# Altium schematic sheet FanBot.SchDoc: Kekketek FanBot
size B; Date: 06/04/2013; ApprovedBy: 6996-1300-0801; CheckedBy: Marcel Lukkesen; DrawnBy: Jacinto Garcia; Engineer: Jacinto Garcia; Organization: J; DocumentNumber: 1; Revision: R01; SheetNumber: 1; SheetTotal: 1; Partnumber: L; ModifiedDate: Ij; ImagePath: Z; ProjectName: Fanbot
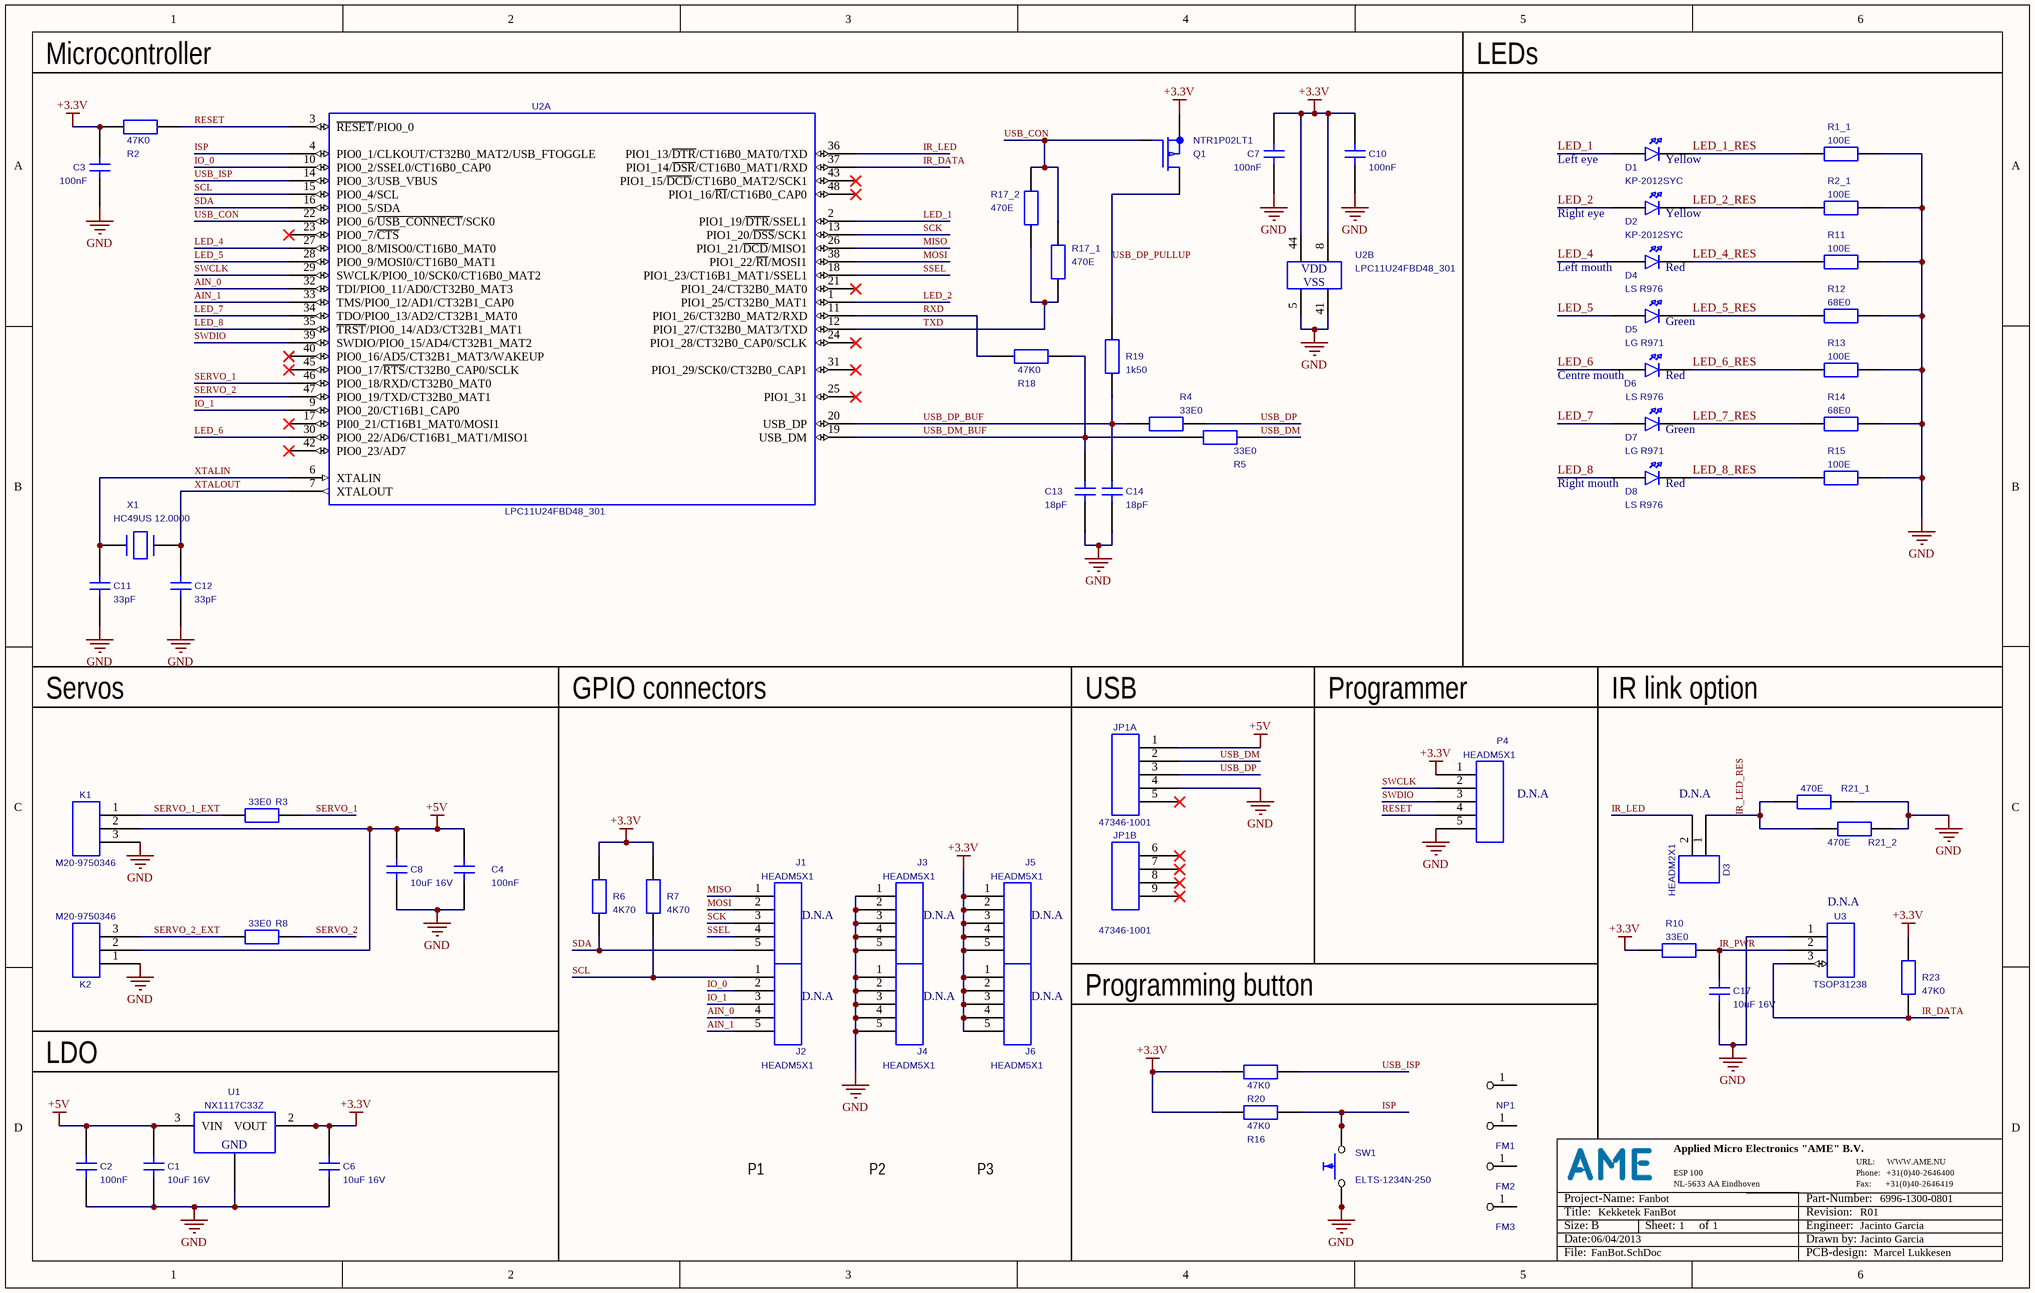
[diagram p0: FanBot.SchDoc]

## Parts
C1  Pvalue: 10uF 16V  [C0805]  (hidden comment: 10U 0805 X5R16V)
C2  Pvalue: 100nF  [C0805]  (hidden comment: 100N 0805 X7R50V)
C3  Pvalue: 100nF  [C0805]  (hidden comment: 100N 0805 X7R50V)
C4  Pvalue: 100nF  [C0805]  (hidden comment: 100N 0805 X7R50V)
C6  Pvalue: 10uF 16V  [C0805]  (hidden comment: 10U 0805 X5R16V)
C7  Pvalue: 100nF  [C0805]  (hidden comment: 100N 0805 X7R50V)
C8  Pvalue: 10uF 16V  [C0805]  (hidden comment: 10U 0805 X5R16V)
C10  Pvalue: 100nF  [C0805]  (hidden comment: 100N 0805 X7R50V)
C11  Pvalue: 33pF  [C0805]  (hidden comment: 33P 0805 X7R50V)
C12  Pvalue: 33pF  [C0805]  (hidden comment: 33P 0805 X7R50V)
C13  Pvalue: 18pF  [C0805]  (hidden comment: 18P 0805 X7R50V)
C14  Pvalue: 18pF  [C0805]  (hidden comment: 18P 0805 X7R50V)
C17  Pvalue: 10uF 16V  [C0805]  (hidden comment: 10U 0805 X5R16V)
D1  KP-2012SYC  [0805 LED]
D2  KP-2012SYC  [0805 LED]
D3  HEADM2X1  [HEADM2X1]
D4  LS R976  [0805 LED OSR]
D5  LG R971  [0805 LED OSR]
D6  LS R976  [0805 LED OSR]
D7  LG R971  [0805 LED OSR]
D8  LS R976  [0805 LED OSR]
FM1  FIDUCIAL MARK 1  [FIDUCIAL MARK 1]  (value not drawn)
FM2  FIDUCIAL MARK 1  [FIDUCIAL MARK 1]  (value not drawn)
FM3  FIDUCIAL MARK 1  [FIDUCIAL MARK 1]  (value not drawn)
J1  HEADM5X1  [M20-9770522]
J2  HEADM5X1  [M20-9770522]
J3  HEADM5X1  [M20-9770522]
J4  HEADM5X1  [M20-9770522]
J5  HEADM5X1  [M20-9770522]
J6  HEADM5X1  [M20-9770522]
JP1  47346-1001  [47346-0001]  (parts A,B of 2)
K1  M20-9750346  [M20-9750346]
K2  M20-9750346  [M20-9750346]
NP1  NULPUNT  [NULPUNT]  (value not drawn)
P4  HEADM5X1  [M20-9770522]
Q1  NTR1P02LT1  [SOT-23]
R1_1  Pvalue: 100E  [R0805]  (hidden comment: 100E 0805 1%)
R2  Pvalue: 47K0  [R0805]  (hidden comment: 47K0 0805 1%)
R2_1  Pvalue: 100E  [R0805]  (hidden comment: 100E 0805 1%)
R3  Pvalue: 33E0  [R0805]  (hidden comment: 33E0 0805 1%)
R4  Pvalue: 33E0  [R0805]  (hidden comment: 33E0 0805 1%)
R5  Pvalue: 33E0  [R0805]  (hidden comment: 33E0 0805 1%)
R6  Pvalue: 4K70  [R0805]  (hidden comment: 4K70 0805 1%)
R7  Pvalue: 4K70  [R0805]  (hidden comment: 4K70 0805 1%)
R8  Pvalue: 33E0  [R0805]  (hidden comment: 33E0 0805 1%)
R10  Pvalue: 33E0  [R0805]  (hidden comment: 33E0 0805 1%)
R11  Pvalue: 100E  [R0805]  (hidden comment: 100E 0805 1%)
R12  Pvalue: 68E0  [R0805]  (hidden comment: 68E0 0805 1%)
R13  Pvalue: 100E  [R0805]  (hidden comment: 100E 0805 1%)
R14  Pvalue: 68E0  [R0805]  (hidden comment: 68E0 0805 1%)
R15  Pvalue: 100E  [R0805]  (hidden comment: 100E 0805 1%)
R16  Pvalue: 47K0  [R0805]  (hidden comment: 47K0 0805 1%)
R17_1  Pvalue: 470E  [R0805]  (hidden comment: 470E 0805 1%)
R17_2  Pvalue: 470E  [R0805]  (hidden comment: 470E 0805 1%)
R18  Pvalue: 47K0  [R0805]  (hidden comment: 47K0 0805 1%)
R19  Pvalue: 1k50  [R0805]  (hidden comment: 1K50 0805 1%)
R20  Pvalue: 47K0  [R0805]  (hidden comment: 47K0 0805 1%)
R21_1  Pvalue: 470E  [R0805]  (hidden comment: 470E 0805 1%)
R21_2  Pvalue: 470E  [R0805]  (hidden comment: 470E 0805 1%)
R23  Pvalue: 47K0  [R0805]  (hidden comment: 47K0 0805 1%)
SW1  ELTS-1234N-250  [ELTS-1234N]
U1  NX1117C33Z  [SOT-223]
U2  LPC11U24FBD48_301  [LQFP48]  (value not drawn)  (parts A,B of 2)
U3  TSOP31238  [TSOP312]
X1  HC49US 12.0000  [HC49/4HSMX]

## Nets
+3.3V: C3.1 C6.1 C7.1 C10.1 J5.1(A1) J5.2(A2) J5.3(A3) J5.4(A4) J5.5(A5) J6.1(A1) J6.2(A2) J6.3(A3) J6.4(A4) J6.5(A5) P4.1(A1) Q1.2(S) R2.2 R6.1 R7.1 R10.1 R16.2 R20.2 R23.1 U1.2(VOUT) U1.4(VOUT) U2.8(VDD) U2.44(VDD)
+5V: C1.1 C2.1 C4.1 C8.1 JP1.1(VBUS) K1.2 K2.2 U1.3(VIN)
GND: C1.2 C2.2 C3.2 C4.2 C6.2 C7.2 C8.2 C10.2 C11.2 C12.2 C13.2 C14.2 C17.2 J3.1(A1) J3.2(A2) J3.3(A3) J3.4(A4) J3.5(A5) J4.1(A1) J4.2(A2) J4.3(A3) J4.4(A4) J4.5(A5) JP1.4(ID) K1.3 K2.1 P4.5(A5) R1_1.2 R2_1.2 R11.2 R12.2 R13.2 R14.2 R15.2 R21_1.2 R21_2.2 SW1.2 SW1.4 U1.1(ADJ/GND) U2.5(VSS) U2.41(VSS) U3.1(GND)
AIN_0: J2.4(A4) U2.32(TDI/PIO0_11/AD0/CT32B0_MAT3)
AIN_1: J2.5(A5) U2.33(TMS/PIO0_12/AD1/CT32B1_CAP0)
IO_0: J2.2(A2) U2.10(PIO0_2/SSEL0/CT16B0_CAP0)
IO_1: J2.3(A3) U2.9(PIO0_20/CT16B1_CAP0)
IR_DATA: R23.2 U2.37(PIO1_14/~{DSR}/CT16B0_MAT1/RXD) U3.3(OUT)
IR_LED: D3.2 U2.36(PIO1_13/~{DTR}/CT16B0_MAT0/TXD)
IR_LED_RES: D3.1 R21_1.1 R21_2.1
IR_PWR: C17.1 R10.2 U3.2(VS)
ISP: R16.1 SW1.1 SW1.3 U2.4(PIO0_1/CLKOUT/CT32B0_MAT2/USB_FTOGGLE)
LED_1: D1.2(A) U2.2(PIO1_19/~{DTR}/SSEL1)
LED_1_RES: D1.1(K) R1_1.1
LED_2: D2.2(A) U2.1(PIO1_25/CT32B0_MAT1)
LED_2_RES: D2.1(K) R2_1.1
LED_4: D4.2(A) U2.27(PIO0_8/MISO0/CT16B0_MAT0)
LED_4_RES: D4.1(K) R11.1
LED_5: D5.2(A) U2.28(PIO0_9/MOSI0/CT16B0_MAT1)
LED_5_RES: D5.1(K) R12.1
LED_6: D6.2(A) U2.30(PIO0_22/AD6/CT16B1_MAT1/MISO1)
LED_6_RES: D6.1(K) R13.1
LED_7: D7.2(A) U2.34(TDO/PIO0_13/AD2/CT32B1_MAT0)
LED_7_RES: D7.1(K) R14.1
LED_8: D8.2(A) U2.35(~{TRST}/PIO0_14/AD3/CT32B1_MAT1)
LED_8_RES: D8.1(K) R15.1
MISO: J1.1(A1) U2.26(PIO1_21/~{DCD}/MISO1)
MOSI: J1.2(A2) U2.38(PIO1_22/~{RI}/MOSI1)
RESET: P4.4(A4) R2.1 U2.3(~{RESET}/PIO0_0)
RXD: R18.2 U2.11(PIO1_26/CT32B0_MAT2/RXD)
SCK: J1.3(A3) U2.13(PIO1_20/~{DSS}/SCK1)
SCL: J2.1(A1) R7.2 U2.15(PIO0_4/SCL)
SDA: J1.5(A5) R6.2 U2.16(PIO0_5/SDA)
SERVO_1: R3.2 U2.46(PIO0_18/RXD/CT32B0_MAT0)
SERVO_1_EXT: K1.1 R3.1
SERVO_2: R8.2 U2.47(PIO0_19/TXD/CT32B0_MAT1)
SERVO_2_EXT: K2.3 R8.1
SSEL: J1.4(A4) U2.18(PIO1_23/CT16B1_MAT1/SSEL1)
SWCLK: P4.2(A2) U2.29(SWCLK/PIO0_10/SCK0/CT16B0_MAT2)
SWDIO: P4.3(A3) U2.39(SWDIO/PIO0_15/AD4/CT32B1_MAT2)
TXD: R17_1.2 R17_2.2 U2.12(PIO1_27/CT32B0_MAT3/TXD)
USB_CON: Q1.1(G) R17_1.1 R17_2.1 U2.22(PIO0_6/~{USB_CONNECT}/SCK0)
USB_DM: JP1.2(D-) R5.2
USB_DM_BUF: C13.1 R5.1 R18.1 U2.19(USB_DM)
USB_DP: JP1.3(D+) R4.2
USB_DP_BUF: C14.1 R4.1 R19.2 U2.20(USB_DP)
USB_DP_PULLUP: Q1.3(D) R19.1
USB_ISP: R20.1 U2.14(PIO0_3/USB_VBUS)
XTALIN: C11.1 U2.6(XTALIN) X1.1
XTALOUT: C12.1 U2.7(XTALOUT) X1.2

Not connected (* = marked no-connect by the designer): FM1 1; FM2 1; FM3 1; JP1 5(GND)* 6(SHIELD)* 7(SHIELD)* 8(SHIELD)* 9(SHIELD)*; NP1 1; U2 17(PI00_21/CT16B1_MAT0/MOSI1)* 21(PIO1_24/CT32B0_MAT0)* 23(PIO0_7/~{CTS})* 24(PIO1_28/CT32B0_CAP0/SCLK)* 25(PIO1_31)* 31(PIO1_29/SCK0/CT32B0_CAP1)* 40(PIO0_16/AD5/CT32B1_MAT3/WAKEUP)* 42(PIO0_23/AD7)* 43(PIO1_15/~{DCD}/CT16B0_MAT2/SCK1)* 45(PIO0_17/~{RTS}/CT32B0_CAP0/SCLK)* 48(PIO1_16/~{RI}/CT16B0_CAP0)*

## Notes on the sheet
- Microcontroller
- LEDs
- Left eye
- (near D1) Yellow
- Right eye
- (near D2) Yellow
- (near D4) Left mouth
- (near D4) Red
- (near D5) Green
- (near D6) Centre mouth
- (near D6) Red
- (near D7) Green
- (near D8) Right mouth
- (near D8) Red
- Servos
- GPIO connectors
- (near JP1) USB
- Programmer
- IR link option
- (near P4) D.N.A
- D.N.A
- (near U3) D.N.A
- (near J1) D.N.A
- (near J3) D.N.A
- (near J5) D.N.A
- (near J2) D.N.A
- (near J4) D.N.A
- (near J6) D.N.A
- Programming button
- LDO
- P1
- P2
- P3
- Applied Micro Electronics "AME" B.V.
- ESP 100
- Phone:   +31(0)40-2646400
- URL:      WWW.AME.NU
- Title:
- Size:
- Date:
- Project-Name:
- B
- Sheet:
- NL-5633 AA Eindhoven
- of
- Engineer:
- Drawn by:
- Revision:
- Part-Number:
- Fax:       +31(0)40-2646419
- File:
- PCB-design:
- (in symbol NX1117C33Z) GND

## Library data of the parts
C1 C6 C8 C17 = 10U 0805 X5R16V: Part Number: 120400051105; Manufacturer: AVX; OrderCode: 0805YD106KAT2A; ModifyDate: 4/17/2013
C2-C4 C7 C10 = 100N 0805 X7R50V: Part Number: 120400011003; Manufacturer: Kemet; OrderCode: C0805C104K5RACTU; Value: *
C11 C12 = 33P 0805 X7R50V: Part Number: 120400013309; Manufacturer: Kemet; OrderCode: C0805C330K5RACTU; Value: *
C13 C14 = 18P 0805 X7R50V: Part Number: 120400011809; Manufacturer: Kemet; OrderCode: C0805C180K5RACTU; Value: *
D1 D2 = KP-2012SYC: Part Number: 206000010035; Manufacturer: Kingbright; Pvalue: YE; Ordercode: KP-2012SYC; ModifyDate: 10/01/2009 12:30:55; Value: *
D3 = HEADM2X1: Part Number: 505000030003; Manufacturer: Harwin; OrderCode: M20-9730206 , 2-polig; ModifyDate: 11/30/2005 12:07:28; Value: *
D4 D6 D8 = LS R976: Part Number: 206000010024; Manufacturer: Osram; Ordercode: Q62702-P5178; Pvalue: *; ModifyDate: 01/13/2011 08:56:36; Value: *
D5 D7 = LG R971: Part Number: 206000010001; Manufacturer: Osram; Ordercode: LGR971-KL; Pvalue: *; ModifyDate: 01/13/2011 08:56:22; Value: *
J1-J6 P4 = HEADM5X1: Part Number: 505000080023; Manufacturer: Harwin; OrderCode: M20-9770522; ModifyDate: 01/11/2012 15:11:41; Value: *
JP1 = 47346-1001: Part Number: 509000220067; Manufacturer: Molex; OrderCode: 47346-1001; ModifyDate: 10/05/2012 13:59:18; Value: *
K1 K2 = M20-9750346: Part Number: 505000080120; Manufacturer: Harwin; OrderCode: M20-9750346; ModifyDate: 4/29/2013
Q1 = NTR1P02LT1: Part Number: 222000010018; Manufacturer: ON Semiconductor; Ordercode: NTR1P02LT1; ModifyDate: 11/23/2007 10:43:03; Value: *
R1_1 R2_1 R11 R13 R15 = 100E 0805 1%: Part Number: 110200011000; Manufacturer: ASJ; OrderCode: CR211000FF; Value: *
R2 R16 R18 R20 R23 = 47K0 0805 1%: Part Number: 110200014702; Manufacturer: ASJ; OrderCode: CR214702FF; Value: *
R3-R5 R8 R10 = 33E0 0805 1%: Part Number: 110200013309; Manufacturer: Yageo; OrderCode: RC0805FR-0733RL; Value: *
R6 R7 = 4K70 0805 1%: Part Number: 110200014701; Manufacturer: ASJ; OrderCode: CR214701FF; Value: *
R12 R14 = 68E0 0805 1%: Part Number: 110200016809; Manufacturer: ASJ; OrderCode: CR216809FF; Value: *
R17_1 R17_2 R21_1 R21_2 = 470E 0805 1%: Part Number: 110200014700; Manufacturer: ASJ; OrderCode: CR214700FF; Value: *
R19 = 1K50 0805 1%: Part Number: 110200011501; Manufacturer: ASJ; OrderCode: CR211501FL; Value: *
SW1 = ELTS-1234N-250: Part Number: 513000010022; Manufacturer: Eledis; Note: PastaOverprint for 125um; OrderCode: ELTS-1234N-250; ModifyDate: 3/25/2013
U1 = NX1117C33Z: Part Number: 330000010048; Manufacturer: NXP Semiconductor; Ordercode: NX1117C33Z,115; ModifyDate: 4/17/2013
U2 = LPC11U24FBD48_301: Part Number: 411000010007; Manufacturer: NXP Semiconductor; OrderCode: LPC11U24FBD48/301; ModifyDate: 4/9/2013
U3 = TSOP31238: Part Number: 324000010007; Manufacturer: Vishay; OrderCode: TSOP31238; ModifyDate: 04/23/2009 11:33:49; Value: *
X1 = HC49US 12.0000: Part Number: 140000010015; Manufacturer: Hong Kong Crystals; PValue: 12.0000MHz; Ordercode: SSM1200000E15FAGZ80S; ModifyDate: 11/29/2010 08:12:29; Value: *
FM1-FM3 = FIDUCIAL MARK 1: Value: *
NP1 = NULPUNT: Value: *